# Altium schematic sheet POWER.SchDoc
size 209 x 297 mm; SheetNumber: 2; SheetTotal: 2
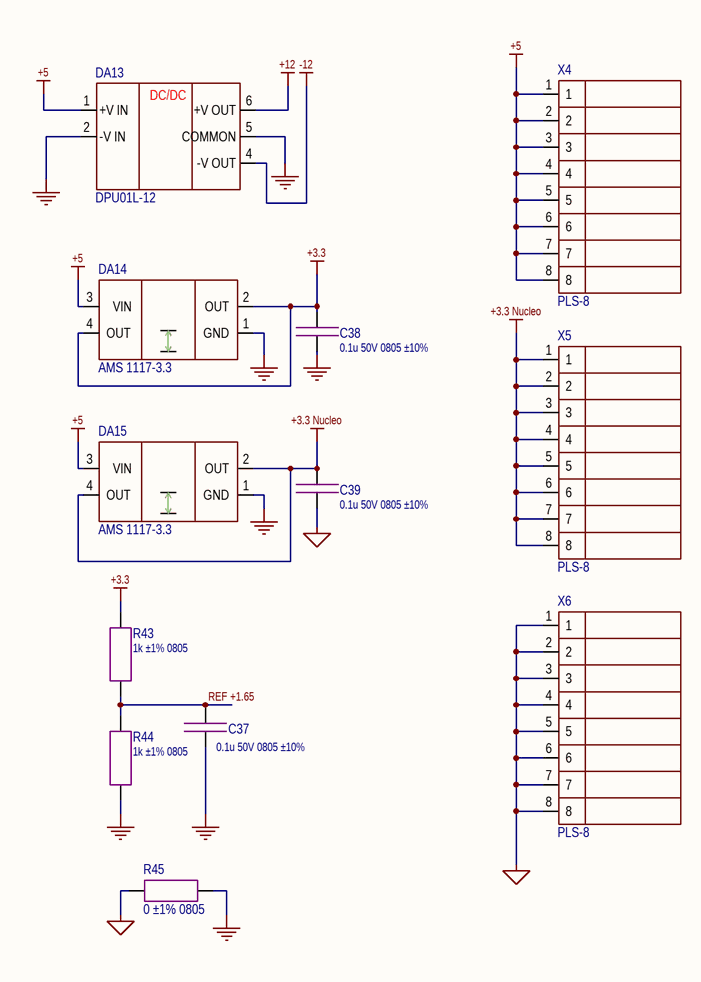
[diagram p0: POWER.SchDoc]

## Parts
C37  0.1u 50V 0805 ±10%  [CAP: SMD 0805 MD IPC 782]
C38  0.1u 50V 0805 ±10%  [CAP: SMD 0805 MD IPC 782]
C39  0.1u 50V 0805 ±10%  [CAP: SMD 0805 MD IPC 782]
DA13  DPU01L-12  [SIP-6]
DA14  AMS 1117-3.3  [IC: SOT 223]
DA15  AMS 1117-3.3  [IC: SOT 223]
R43  1k ±1% 0805  [RES: SMD 0805 MD IPC 782]
R44  1k ±1% 0805  [RES: SMD 0805 MD IPC 782]
R45  0 ±1% 0805  [RES: SMD 0805 MD IPC 782]
X4  PLS-8  [CON: 8PIN PLS-8]
X5  PLS-8  [CON: 8PIN PLS-8]
X6  PLS-8  [CON: 8PIN PLS-8]

## Nets
+3.3: C38.1 DA14.2(OUT) DA14.4(OUT) R43.2
+3.3 Nucleo: C39.1 DA15.2(OUT) DA15.4(OUT) X5.1 X5.2 X5.3 X5.4 X5.5 X5.6 X5.7 X5.8
+5: DA13.1(+V_IN) DA14.3(VIN) DA15.3(VIN) X4.1 X4.2 X4.3 X4.4 X4.5 X4.6 X4.7 X4.8
+12: DA13.6(+V_OUT)
-12: DA13.4(-V_OUT)
GND: C37.2 C38.2 DA13.2(-V_IN) DA13.5(COMMON) DA14.1(GND) DA15.1(GND) R44.1 R45.2
GNDD: C39.2 R45.1 X6.1 X6.2 X6.3 X6.4 X6.5 X6.6 X6.7 X6.8
REF +1.65: C37.1 R43.1 R44.2

## Notes on the sheet
- Перв. примен.
- Справ. №
- Подп. и дата
- Инв. № дубл.
- Взам. инв. №
- Разраб.
- Изм.
- Лист
- № докум.
- Подп.
- Дата
- Литера
- Масса
- Масштаб
- Пров.
- Т.контр.
- Листов
- Инв. № подл.
- Н.контр.
- Утв.
- Форма 1 ГОСТ 2.104-2006
- Копировал
- Формат А4
- (in symbol DC-DC: +12/-12V DPU01L-12) DC/DC

## Library data of the parts
C37-C39 = 0.1u 50V 0805 ±10%: Code: 6279254871; Name: Конденсатор X7R 50V 0,1uF ±10% 0805
DA13 = DC-DC: +12/-12V DPU01L-12: Code: 6339113551; Name: Микросхема AM2D-0512DZ, AIMTEC
DA14 DA15 = LDO: 15-3.3V AMS1117: Code: 6339112951; Name: Микросхема AMS-1117-3.3
R43 R44 = 1k ±1% 0805: Code: 6027158691; Name: Резистор RC0805FR-071KL, Yageo
R45 = 0 ±1% 0805: Code: 6094342239; Name: Резистор 0R ±1% 0805
X4-X6 = 8 pin PLS 8